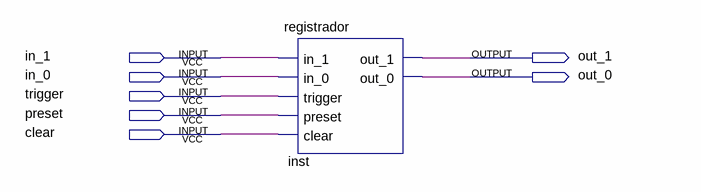
[diagram p0: schematic sheet]
// Quartus schematic ir2b.bdf as structural Verilog: 1 symbols, 7 pins
module ir2b (
  input  in_1,
  input  in_0,
  input  trigger,
  input  preset,
  input  clear,
  output out_1,
  output out_0
);

  registrador inst (
    .in_1(in_1), .in_0(in_0), .trigger(trigger), .preset(preset), .clear(clear), .out_1(out_1), .out_0(out_0));
endmodule
